# Altium project 飞控.PrjPCB
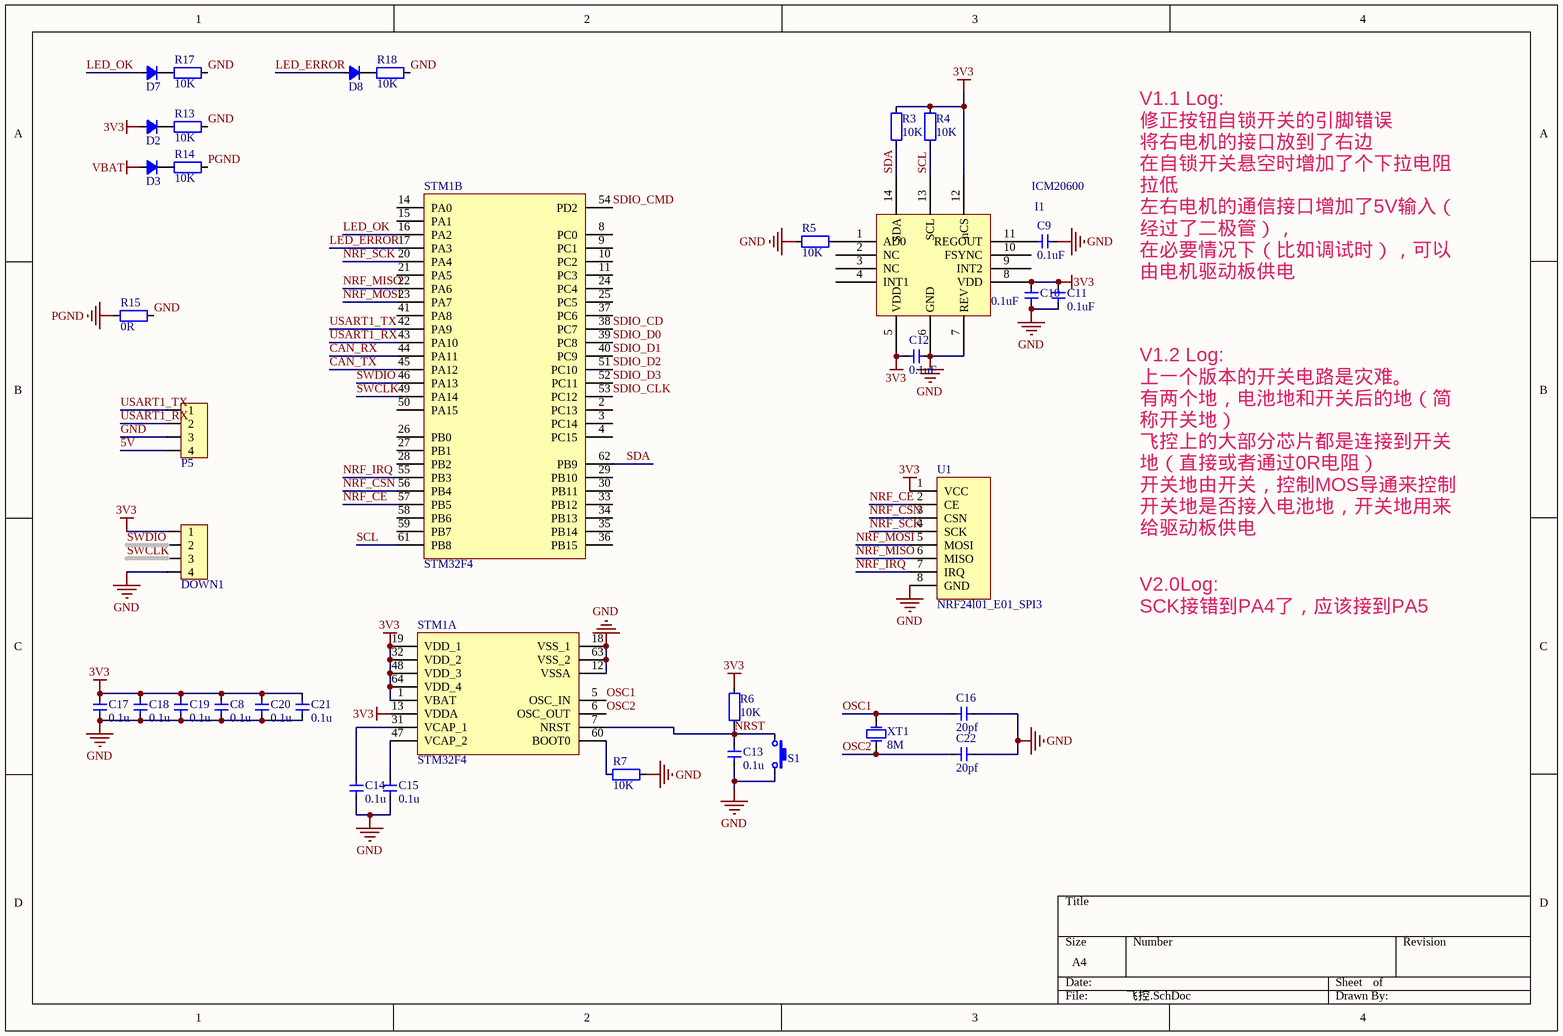
[diagram p0: 飞控.SchDoc]
2 sheets, 72 parts. Net scope: global (net labels, ports and power ports of the same name join across sheets).
Board file: 双旋翼飞控pcb.PcbDoc
Sheets:
  飞控.SchDoc
  power.SchDoc

## Sheet 飞控.SchDoc
size A4

### Parts
C8  value 0.1u  [CAP_0603]  (hidden comment: Cap_0603)
C9  value 0.1uF  [CAP_0603]  (hidden comment: Cap_0603)
C10  value 0.1uF  [CAP_0603]  (hidden comment: Cap_0603)
C11  value 0.1uF  [CAP_0603]  (hidden comment: Cap_0603)
C12  value 0.1uF  [CAP_0603]  (hidden comment: Cap_0603)
C13  value 0.1u  [CAP_0603]  (hidden comment: Cap_0603)
C14  value 0.1u  [CAP_0603]  (hidden comment: Cap_0603)
C15  value 0.1u  [CAP_0603]  (hidden comment: Cap_0603)
C16  value 20pf  [CAP_0603]  (hidden comment: Cap_0603)
C17  value 0.1u  [CAP_0603]  (hidden comment: Cap_0603)
C18  value 0.1u  [CAP_0603]  (hidden comment: Cap_0603)
C19  value 0.1u  [CAP_0603]  (hidden comment: Cap_0603)
C20  value 0.1u  [CAP_0603]  (hidden comment: Cap_0603)
C21  value 0.1u  [CAP_0603]  (hidden comment: Cap_0603)
C22  value 20pf  [CAP_0603]  (hidden comment: Cap_0603)
D2  D_0805  [LED_0805_YELLOW]  (value not drawn)
D3  D_0805  [LED_0805_YELLOW]  (value not drawn)
D7  D_0805  [LED_0805_YELLOW]  (value not drawn)
D8  D_0805  [LED_0805_YELLOW]  (value not drawn)
DOWN1  HDR1x4_2.54  [HDR1x4_2.54_180]  (value not drawn)
I1  ICM20600  [ICM20600]
P5  HDR1x4_2.54  [HDR1x4_2.54_180]  (value not drawn)
R3  value 10K  [RES_0603]  (hidden comment: Res_0603)
R4  value 10K  [RES_0603]  (hidden comment: Res_0603)
R5  value 10K  [RES_0603]  (hidden comment: Res_0603)
R6  value 10K  [RES_0603]  (hidden comment: Res_0603)
R7  value 10K  [RES_0603]  (hidden comment: Res_0603)
R13  value 10K  [RES_0603]  (hidden comment: Res_0603)
R14  value 10K  [RES_0603]  (hidden comment: Res_0603)
R15  value 0R  [RES_0603]  (hidden comment: Res_0603)
R17  value 10K  [RES_0603]  (hidden comment: Res_0603)
R18  value 10K  [RES_0603]  (hidden comment: Res_0603)
S1  ButtonTACT_3x4x2_180  [ButtonTACT_3x4x2_180H]  (value not drawn)
STM1  STM32F4  [LQFP_P0.5_64]  (parts A,B of 2)
U1  NRF24l01_E01_SPI3  [E01-ML01SP2]
XT1  value 8M  [XT_5032_2]  (hidden comment: XTAL_5032_2P)

### Nets
3V3: C8.2 C10.1 C11.1 C12.2 C17.2 C18.2 C19.2 C20.2 C21.2 D2.1(A) DOWN1.1 I1.5(VDD) I1.8(VDD) I1.12(nCS) R3.1 R4.1 R6.1 STM1.1(VBAT) STM1.13(VDDA) STM1.19(VDD_1) STM1.32(VDD_2) STM1.48(VDD_3) STM1.64(VDD_4) U1.1(VCC)
5V: P5.4
GND: C8.1 C9.2 C10.2 C11.2 C12.1 C13.1 C14.2 C15.2 C16.1 C17.1 C18.1 C19.1 C20.1 C21.1 C22.1 DOWN1.4 I1.6(GND) I1.7(REV) P5.3 R5.1 R7.2 R13.2 R15.2 R17.2 R18.2 S1.2 STM1.12(VSSA) STM1.18(VSS_1) STM1.63(VSS_2) U1.8(GND)
PGND: R14.2 R15.1
VBAT: D3.1(A)
CAN_RX: STM1.44(PA11)
CAN_TX: STM1.45(PA12)
LED_ERROR: D8.1(A) STM1.17(PA3)
LED_OK: D7.1(A) STM1.16(PA2)
NRF_CE: STM1.57(PB5) U1.2(CE)
NRF_CSN: STM1.56(PB4) U1.3(CSN)
NRF_IRQ: STM1.55(PB3) U1.7(IRQ)
NRF_MISO: STM1.22(PA6) U1.6(MISO)
NRF_MOSI: STM1.23(PA7) U1.5(MOSI)
NRF_SCK: STM1.20(PA4) U1.4(SCK)
NRST: C13.2 R6.2 S1.1 STM1.7(NRST)
OSC1: C16.2 STM1.5(OSC_IN) XT1.2(OSC2)
OSC2: C22.2 STM1.6(OSC_OUT) XT1.1(OSC1)
SCL: I1.13(SCL) R4.2 STM1.61(PB8)
SDA: I1.14(SDA) R3.2 STM1.62(PB9)
SDIO_CD: STM1.38(PC7)
SDIO_CLK: STM1.53(PC12)
SDIO_CMD: STM1.54(PD2)
SDIO_D0: STM1.39(PC8)
SDIO_D1: STM1.40(PC9)
SDIO_D2: STM1.51(PC10)
SDIO_D3: STM1.52(PC11)
SWCLK: DOWN1.3 STM1.49(PA14)
SWDIO: DOWN1.2 STM1.46(PA13)
USART1_RX: P5.2 STM1.43(PA10)
USART1_TX: P5.1 STM1.42(PA9)
NetC9_1: C9.1 I1.11(REGOUT)
NetC14_1: C14.1 STM1.31(VCAP_1)
NetC15_1: C15.1 STM1.47(VCAP_2)
NetD2_2: D2.2(K) R13.1
NetD3_2: D3.2(K) R14.1
NetD7_2: D7.2(K) R17.1
NetD8_2: D8.2(K) R18.1
NetI1_1: I1.1(AD0) R5.2
NetR7_1: R7.1 STM1.60(BOOT0)

Not connected (* = marked no-connect by the designer): I1 2(NC) 3(NC) 4(INT1) 9(INT2) 10(FSYNC); STM1 2(PC13) 3(PC14) 4(PC15) 8(PC0) 9(PC1) 10(PC2) 11(PC3) 14(PA0) 15(PA1) 21(PA5) 24(PC4) 25(PC5) 26(PB0) 27(PB1) 28(PB2) 29(PB10) 30(PB11) 33(PB12) 34(PB13) 35(PB14) 36(PB15) 37(PC6) 41(PA8) 50(PA15) 58(PB6) 59(PB7)

### Notes on the sheet
- V1.1 Log:
  修正按钮自锁开关的引脚错误
  将右电机的接口放到了右边
  在自锁开关悬空时增加了个下拉电阻拉低
  左右电机的通信接口增加了5V输入（经过了二极管），
  在必要情况下（比如调试时），可以由电机驱动板供电
- V1.2 Log:
  上一个版本的开关电路是灾难。
  有两个地，电池地和开关后的地（简称开关地）
  飞控上的大部分芯片都是连接到开关地（直接或者通过0R电阻）
  开关地由开关，控制MOS导通来控制开关地是否接入电池地，开关地用来给驱动板供电
  而飞控和驱动板之间通过SCK,CSN,MO,MI,G，连接在一起。这里的G是飞控的开关地。
  由于SCK这些引脚内部是连到单片机中的，实际上相当于这些引脚经过一个二极管反向
  练到单片机地（即电池地），因此将飞控和驱动板连接后，即使开关没有作用，电池地和
  开关地也会几乎连在一起。几乎的意思是说是由两边单片机的二级管导致的等效连在一起。
  而一旦打开开关，开关地会连到电池地上，导致电压有个突变，这个突变就容易将单片机烧了。
  实测烧了3片f405
- V2.0Log:
  SCK接错到PA4了，应该接到PA5

### Library data of the parts
C8-C22 = Cap_0603: Capacitor
DOWN1 P5 = HDR1x4_2.54: Header
R3-R7 R13-R15 R17 R18 = Res_0603: Resistor
S1 = ButtonTACT_3x4x2_180: Button
STM1 = STM32F405R: MCU
U1 = NRF24l01_E01_SPI2
XT1 = XTAL_5032_2P: Crystal Oscillator

## Sheet power.SchDoc
size A4
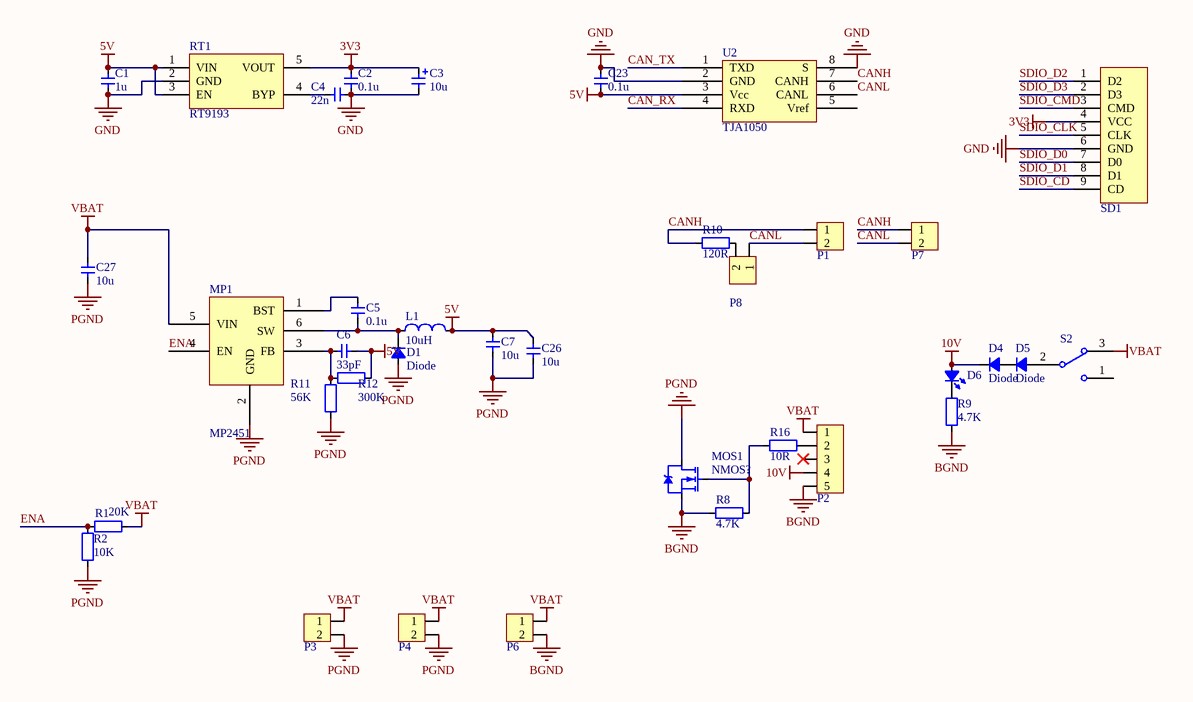
[diagram p1: power.SchDoc]

### Parts
C1  value 1u  [CAP_0603]  (hidden comment: Cap_0603)
C2  value 0.1u  [CAP_0603]  (hidden comment: Cap_0603)
C3  value 10u  [CAP_TAN_P0805]  (hidden comment: Cap_Tan_0805)
C4  value 22n  [CAP_0603]  (hidden comment: Cap_0603)
C5  value 0.1u  [CAP_0603]  (hidden comment: Cap_0603)
C6  value 33pF  [CAP_0603]  (hidden comment: Cap_0603)
C7  value 10u  [CAP_0805]  (hidden comment: Cap_0805)
C23  value 0.1u  [CAP_0603]  (hidden comment: Cap_0603)
C26  value 10u  [CAP_0805]  (hidden comment: Cap_0805)
C27  value 10u  [CAP_0805]  (hidden comment: Cap_0805)
D1  Diode  [LED_0805_RED]
D4  Diode  [LED_0805_RED]
D5  Diode  [LED_0805_RED]
D6  LED_0805  [LED_0805_RED]  (value not drawn)
L1  value 10uH  [IND_CD52]  (hidden comment: Ind_CD32)
MOS1  value NMOS?  [TO-252AA]  (hidden comment: MOSFET_N)
MP1  MP2451  [SOT23-6]
P1  HDR1x2_2.54  [HDR1X2_2.54_90]  (value not drawn)
P2  HDR1x5_2.54  [HDR1X5_2.54_180]  (value not drawn)
P3  Connector  [XT30_PW_M]  (value not drawn)
P4  Connector  [XT30_PW_M]  (value not drawn)
P6  Connector  [XT30_PW_M]  (value not drawn)
P7  HDR1x2_2.54  [HDR1X2_2.54_90]  (value not drawn)
P8  HDR1x2_2.54  [HDR1X2_2.54_180]  (value not drawn)
R1  value 20K  [RES_0603]  (hidden comment: Res_0603)
R2  value 10K  [RES_0603]  (hidden comment: Res_0603)
R8  value 4.7K  [RES_0603]  (hidden comment: Res_0603)
R9  value 4.7K  [RES_0603]  (hidden comment: Res_0603)
R10  value 120R  [RES_0603]  (hidden comment: Res_0603)
R11  value 56K  [RES_0603]  (hidden comment: Res_0603)
R12  value 300K  [RES_0603]  (hidden comment: Res_0603)
R16  value 10R  [RES_0603]  (hidden comment: Res_0603)
RT1  RT9193  [SOT23-5]
S2  SwitchSPDT_2.8x6.6_90  [SwitchSPDT_2.8X6.6_90]  (value not drawn)
SD1  SD_Card_TF  [SD_Card_TF]  (value not drawn)
U2  TJA1050  [SOP_E150_8]

### Nets
3V3: C2.2 C3.1 RT1.5(VOUT) SD1.4(VCC)
5V: C1.2 C6.1 C7.2 C23.1 C26.2 L1.2 R12.2 RT1.1(VIN) RT1.3(EN) U2.3(Vcc)
10V: D4.2(K) D6.1(A) P2.4
BGND: MOS1.3(S) P2.5 P6.2 R8.2 R9.1
GND: C1.1 C2.1 C3.2 C4.1 C23.2 RT1.2(GND) SD1.6(GND) U2.2(GND) U2.8(S)
PGND: C7.1 C26.1 C27.1 D1.1(A) MOS1.4(D) MP1.2(GND) P3.2 P4.2 R2.2 R11.2
VBAT: C27.2 MP1.5(VIN) P2.1 P3.1 P4.1 P6.1 R1.2 S2.3
CAN_RX: U2.4(RXD)
CAN_TX: U2.1(TXD)
CANH: P1.1 P7.1 R10.2 U2.7(CANH)
CANL: P1.2 P7.2 P8.1 U2.6(CANL)
ENA: MP1.4(EN) R1.1 R2.1
SDIO_CD: SD1.9(CD)
SDIO_CLK: SD1.5(CLK)
SDIO_CMD: SD1.3(CMD)
SDIO_D0: SD1.7(D0)
SDIO_D1: SD1.8(D1)
SDIO_D2: SD1.1(D2)
SDIO_D3: SD1.2(D3)
NetC4_2: C4.2 RT1.4(BYP)
NetC5_1: C5.1 D1.2(K) L1.1 MP1.6(SW)
NetC5_2: C5.2 MP1.1(BST)
NetC6_2: C6.2 MP1.3(FB) R11.1 R12.1
NetD4_1: D4.1(A) D5.2(K)
NetD5_1: D5.1(A) S2.2
NetD6_2: D6.2(K) R9.2
NetMOS1_1: MOS1.1(G) R8.1 R16.2
NetP2_2: P2.2 R16.1
NetP8_2: P8.2 R10.1

Not connected (* = marked no-connect by the designer): P2 3*; S2 1; U2 5(Vref)

### Library data of the parts
C1 C2 C4-C6 C23 = Cap_0603: Capacitor
C3 = Cap_Tan_0805: Capacitor
C7 C26 C27 = Cap_0805: Capacitor
D6 = LED_0805: LED
L1 = Ind_CD32: Inductor
MOS1 = MOSFET_N: MOSFET
P1 P7 P8 = HDR1x2_2.54: Header
P2 = HDR1x5_2.54: Header
P3 P4 P6 = 2P
R1 R2 R8-R12 R16 = Res_0603: Resistor
RT1 = RT9193: Power
S2 = SwitchSPDT_2.8x6.6_90: Switch
SD1 = SD_Card_TF: SD

## Nets that join several sheets
3V3: 飞控 (24 pins), power (C2.2 C3.1 RT1.5 SD1.4)
5V: 飞控 (P5.4), power (10 pins)
GND: 飞控 (30 pins), power (9 pins)
PGND: 飞控 (R14.2 R15.1), power (10 pins)
VBAT: 飞控 (D3.1), power (8 pins)
CAN_RX: 飞控 (STM1.44), power (U2.4)
CAN_TX: 飞控 (STM1.45), power (U2.1)
SDIO_CD: 飞控 (STM1.38), power (SD1.9)
SDIO_CLK: 飞控 (STM1.53), power (SD1.5)
SDIO_CMD: 飞控 (STM1.54), power (SD1.3)
SDIO_D0: 飞控 (STM1.39), power (SD1.7)
SDIO_D1: 飞控 (STM1.40), power (SD1.8)
SDIO_D2: 飞控 (STM1.51), power (SD1.1)
SDIO_D3: 飞控 (STM1.52), power (SD1.2)